# Altium schematic sheet Peripherals.SchDoc: Peripherals
size A3; Project: STM32L073Z-EVAL; Date: Not used; ApprovedBy: Not used; CheckedBy: Not used; Author: Not used; CompanyName: STMicroelectronics; DrawnBy: Not used; Engineer: Not used; Organization: Not used; Address1: Not used; Address2: Not used; Address3: Not used; Address4: Not used; DocumentNumber: 5; Revision: Not used; SheetNumber: 6; SheetTotal: 13; CurrentTime: Not used; CurrentDate: Not used; Time: Not used; DocumentFullPathAndName: Not used; DocumentName: Not used; ModifiedDate: Not used; ImagePath: Not used; ProjectName: Not used; Application_BuildNumber: Not used
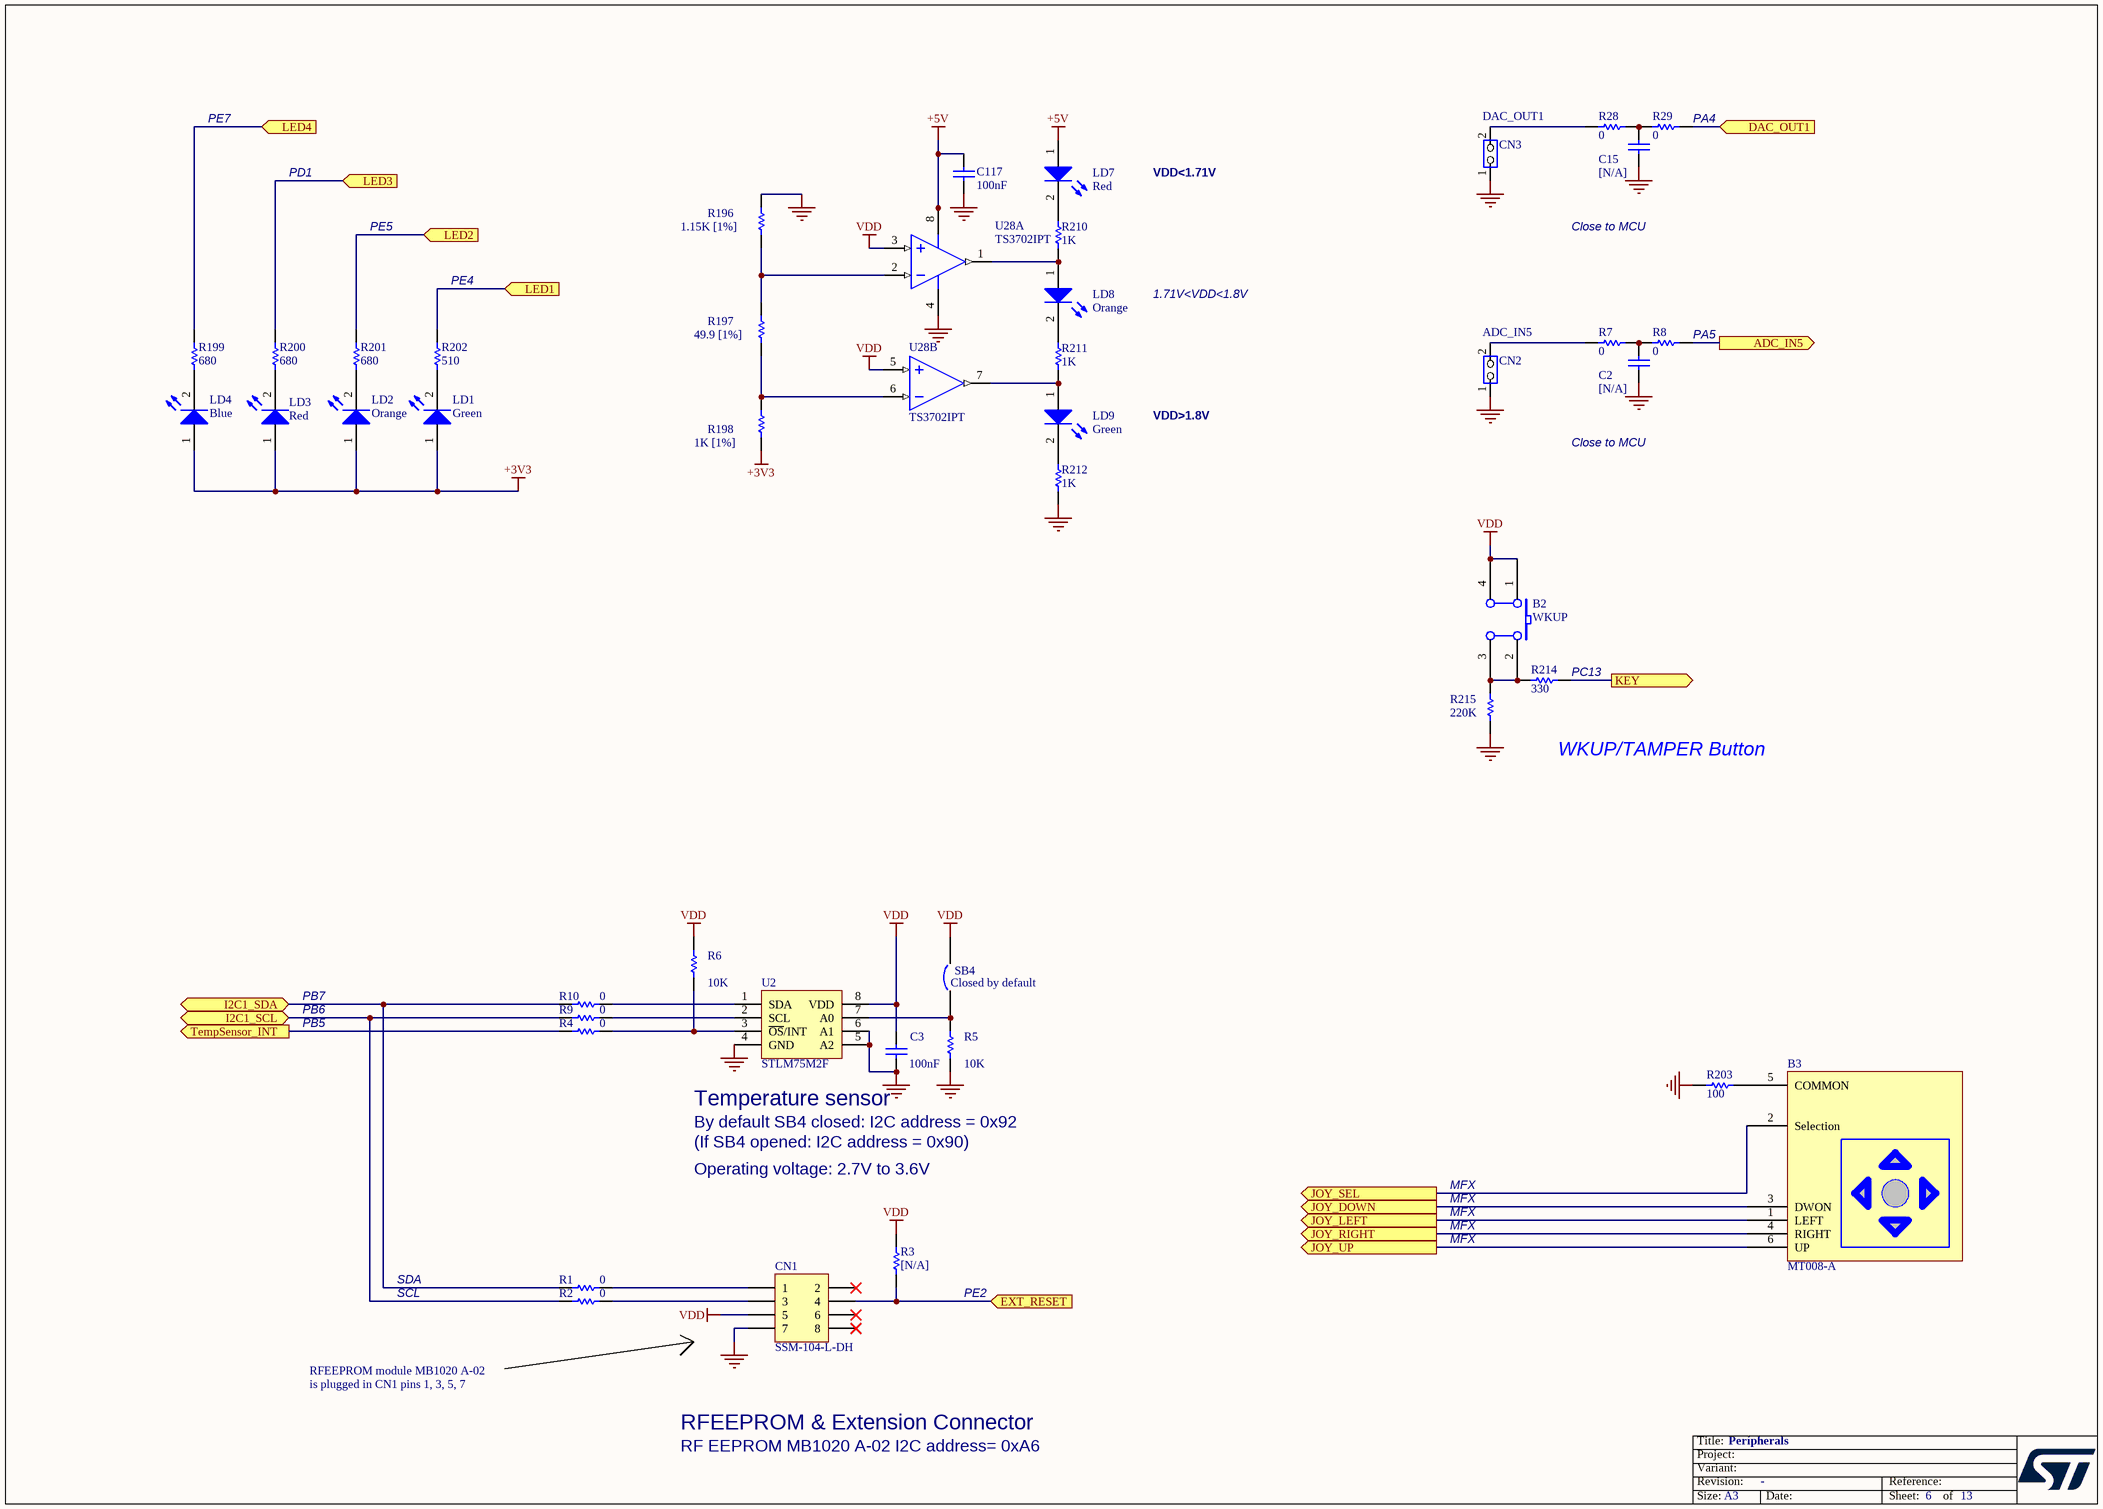
[diagram p0: Peripherals.SchDoc]

## Parts
B2  WKUP  [PB10]
B3  MT008-A  [MT-008A]
C2  [N/A]  [0603C]
C3  100nF  [0402C]
C15  [N/A]  [0603C]
C117  100nF  [0402C]
CN1  SSM-104-L-DH  [SSM-104-L-DH]
CN2  Silkscreen: ADC_IN5  [SIP2]  (hidden comment: Header 2X1)
CN3  Silkscreen: DAC_OUT1  [SIP2]  (hidden comment: Header 2X1)
LD1  Green  [0603D]
LD2  Orange  [0603D]
LD3  Red  [0603D]
LD4  Blue  [0603D]
LD7  Red  [0603D]
LD8  Orange  [0603D]
LD9  Green  [0603D]
R1  0  [0603R]
R2  0  [0603R]
R3  [N/A]  [0603R]
R4  0  [0603R]
R5  10K  [0402R]
R6  10K  [0402R]
R7  0  [0603R]
R8  0  [0603R]
R9  0  [0603R]
R10  0  [0603R]
R28  0  [0603R]
R29  0  [0603R]
R196  1.15K [1%]  [0603R]
R197  49.9 [1%]  [0603R]
R198  1K [1%]  [0603R]
R199  680  [0402R]
R200  680  [0402R]
R201  680  [0402R]
R202  510  [0402R]
R203  100  [0402R]
R210  1K  [0402R]
R211  1K  [0402R]
R212  1K  [0402R]
R214  330  [0603R]
R215  220K  [0402R]
SB4  Closed by default  [SB_0603]
U2  STLM75M2F  [SOIC8_1R27_4R9X6]
U28  TS3702IPT  [TSSOP8_0R65_3X6R4]  (parts A,B of 2)

## Ports
ADC_IN5 (out), DAC_OUT1 (in), EXT_RESET (in), I2C1_SCL (bidir), I2C1_SDA (bidir), JOY_DOWN (out), JOY_LEFT (out), JOY_RIGHT (out), JOY_SEL (out), JOY_UP (out), KEY (out), LED1 (in), LED2 (in), LED3 (in), LED4 (in), TempSensor_INT (out)

## Nets
+3V3: LD1.1(A) LD2.1(A) LD3.1(A) LD4.1(A) R198.1
+5V: C117.2 LD7.1(A) U28.8(V+)
GND: C2.1 C3.1 C15.1 C117.1 CN1.7 CN2.1(COMMON) CN3.1(COMMON) R5.2 R196.2 R203.1 R212.2 R215.2 U2.4(GND) U2.5(A2) U2.6(A1) U28.4(V-)
VDD: B2.1(A0) B2.4(A1) C3.2 CN1.5 R3.2 R6.1 SB4.2 U2.8(VDD) U28.3(IN+) U28.5(IN+)
ADC_IN5: R8.2 ; port ADC_IN5
DAC_OUT1: R29.2 ; port DAC_OUT1
EXT_RESET: CN1.4 R3.1 ; port EXT_RESET
I2C1_SCL: R2.1 R9.1 ; port I2C1_SCL
I2C1_SDA: R1.1 R10.1 ; port I2C1_SDA
JOY_DOWN: B3.3(DWON) ; port JOY_DOWN
JOY_LEFT: B3.1(LEFT) ; port JOY_LEFT
JOY_RIGHT: B3.4(RIGHT) ; port JOY_RIGHT
JOY_SEL: B3.2(Selection) ; port JOY_SEL
JOY_UP: B3.6(UP) ; port JOY_UP
KEY: R214.2 ; port KEY
LED1: R202.1 ; port LED1
LED2: R201.1 ; port LED2
LED3: R200.1 ; port LED3
LED4: R199.1 ; port LED4
TempSensor_INT: R4.2 ; port TempSensor_INT
NetB2_2: B2.2(B0) B2.3(B1) R214.1 R215.1
NetB3_5: B3.5(COMMON) R203.2
NetC2_2: C2.2 R7.2 R8.1
NetC15_2: C15.2 R28.2 R29.1
NetCN1_1: CN1.1 R1.2
NetCN1_3: CN1.3 R2.2
NetCN2_2: CN2.2(NO) R7.1
NetCN3_2: CN3.2(NO) R28.1
NetLD1_2: LD1.2(K) R202.2
NetLD2_2: LD2.2(K) R201.2
NetLD3_2: LD3.2(K) R200.2
NetLD4_2: LD4.2(K) R199.2
NetLD7_2: LD7.2(K) R210.1
NetLD8_1: LD8.1(A) R210.2 U28.1(OUT)
NetLD8_2: LD8.2(K) R211.1
NetLD9_1: LD9.1(A) R211.2 U28.7(OUT)
NetLD9_2: LD9.2(K) R212.1
NetR4_1: R4.1 R6.2 U2.3(~{OS}/INT)
NetR5_1: R5.1 SB4.1 U2.7(A0)
NetR9_2: R9.2 U2.2(SCL)
NetR10_2: R10.2 U2.1(SDA)
NetR196_1: R196.1 R197.2 U28.2(IN-)
NetR197_1: R197.1 R198.2 U28.6(IN-)

Not connected (* = marked no-connect by the designer): CN1 2* 6* 8*

## Notes on the sheet
- PE7
- PD1
- VDD<1.71V
- (near R29) PA4
- PE5
- Close to MCU
- PE4
- 1.71V<VDD<1.8V
- (near R8) PA5
- VDD>1.8V
- (near R214) PC13
- WKUP/TAMPER Button
- PB7
- PB6
- PB5
- Temperature sensor
- By default SB4 closed: I2C address = 0x92
- Operating voltage: 2.7V to 3.6V
- (If SB4 opened: I2C address = 0x90)
- MFX
- SDA
- SCL
- PE2
- RFEEPROM module MB1020 A-02
  is plugged in CN1 pins 1, 3, 5, 7
- RF EEPROM MB1020 A-02 I2C address= 0xA6
- RFEEPROM & Extension Connector
- Title:
- Project:
- Size:
- Revision:
- Variant:
- A3
- -
- Date:
- Reference:
- Sheet:
- of

## Library data of the parts
B2 = SW PUSHBUTTON: SE PUSHBUTTON; Ordered by: Subcon; Assembly: Blue; Silkscreen: Wkup/Tamper; ECCN_US/EU: n/a
B3 = MT-008A: Joystick; Ordered by: Subcon; Assembly: with button; Silkscreen: Joystick; ECCN_US/EU: n/a
C2 C15 = cap: Capacitor; Value: 100pF; Ordered by: Subcon; Fitted: NO; Published: 8-Jun-2000; Revision: July-2002: Re-released for DXP Platform.; Publisher: Altium Limited; ECCN_US/EU: n/a
C3 = cap: Capacitor; Value: 100pF; Ordered by: Subcon; Published: 8-Jun-2000; Revision: July-2002: Re-released for DXP Platform.; Publisher: Altium Limited; ECCN_US/EU: n/a
C117 = CAP: Capacitor; Value: 100pF; Ordered by: Subcon; Published: 8-Jun-2000; Revision: July-2002: Re-released for DXP Platform.; Publisher: Altium Limited; ECCN_US/EU: n/a
CN1 = SSM-104-L-DH: Header, 5-Pin, Dual row; Manuf_1: towneS; Manuf_Part_1: F206A-2*04MGF-A; Ordered by: Subcon; Silkscreen: RF_EEPROM; Assembly: with ANT7-M24LR-A (MB1020-A02); Revision: 17-Jul-2002: Re-released for DXP Platform.; Publisher: Altium Limited; ECCN_US/EU: n/a
CN2 CN3 = JP2: Manuf_1: LWCONN; Manuf_Part_1: 313102S111116; Ordered by: Subcon; ECCN_US/EU: n/a
LD1-LD4 LD8 = LED2: Typical RED, GREEN, YELLOW, AMBER GaAs LED; Ordered by: Subcon; Published: 8-Jun-2000; Revision: July-2002: Re-released for DXP Platform.; Publisher: Altium Limited; ECCN_US/EU: n/a
LD7 = LED2: Typical RED, GREEN, YELLOW, AMBER GaAs LED; Ordered by: Subcon; Silkscreen: VDD<1.7V; Published: 8-Jun-2000; Revision: July-2002: Re-released for DXP Platform.; Publisher: Altium Limited; ECCN_US/EU: n/a
LD9 = LED2: Typical RED, GREEN, YELLOW, AMBER GaAs LED; Ordered by: Subcon; Silkscreen: VDD>1.8V; Published: 8-Jun-2000; Revision: July-2002: Re-released for DXP Platform.; Publisher: Altium Limited; ECCN_US/EU: n/a
R1 R2 R4 R7-R10 R28 R29 R196 R197 R199-R203 R214 = Res1: Resistor; Value: 1K; Ordered by: Subcon; Published: 8-Jun-2000; Revision: July-2002: Re-released for DXP Platform.; Publisher: Altium Limited; ECCN_US/EU: n/a
R3 = Res1: Resistor; Value: 1K; Ordered by: Subcon; Fitted: NO; Published: 8-Jun-2000; Revision: July-2002: Re-released for DXP Platform.; Publisher: Altium Limited; ECCN_US/EU: n/a
R5 R6 R215 = res1: Resistor; Value: 1K; Ordered by: Subcon; Published: 8-Jun-2000; Revision: July-2002: Re-released for DXP Platform.; Publisher: Altium Limited; ECCN_US/EU: n/a
R198 R210-R212 = Res1: Resistor; Ordered by: Subcon; Published: 8-Jun-2000; Revision: July-2002: Re-released for DXP Platform.; Publisher: Altium Limited; Value: 1K; ECCN_US/EU: n/a
SB4 = Circuit Breaker: Ordered by: Subcon; Comments: Solder bridge; Published: 24-Mar-1999; Revision: July-2002: Re-released for DXP Platform.; Publisher: Altium Limited; ECCN_US/EU: n/a
U2 = STLM75DW2F: Ordered by: ST; ECCN_US/EU: EAR99/NEC; Ref St: 9177005; Manuf_1: ST; Manuf_Part_1: STLM75M2F
U28 = LM393PT: Ordered by: ST; ECCN_US/EU: EAR99/NEC; Ref St: 9177424; Manuf_1: ST; Manuf_Part_1: TS3702IPT